# Altium project Flow_Pump.PrjPcb
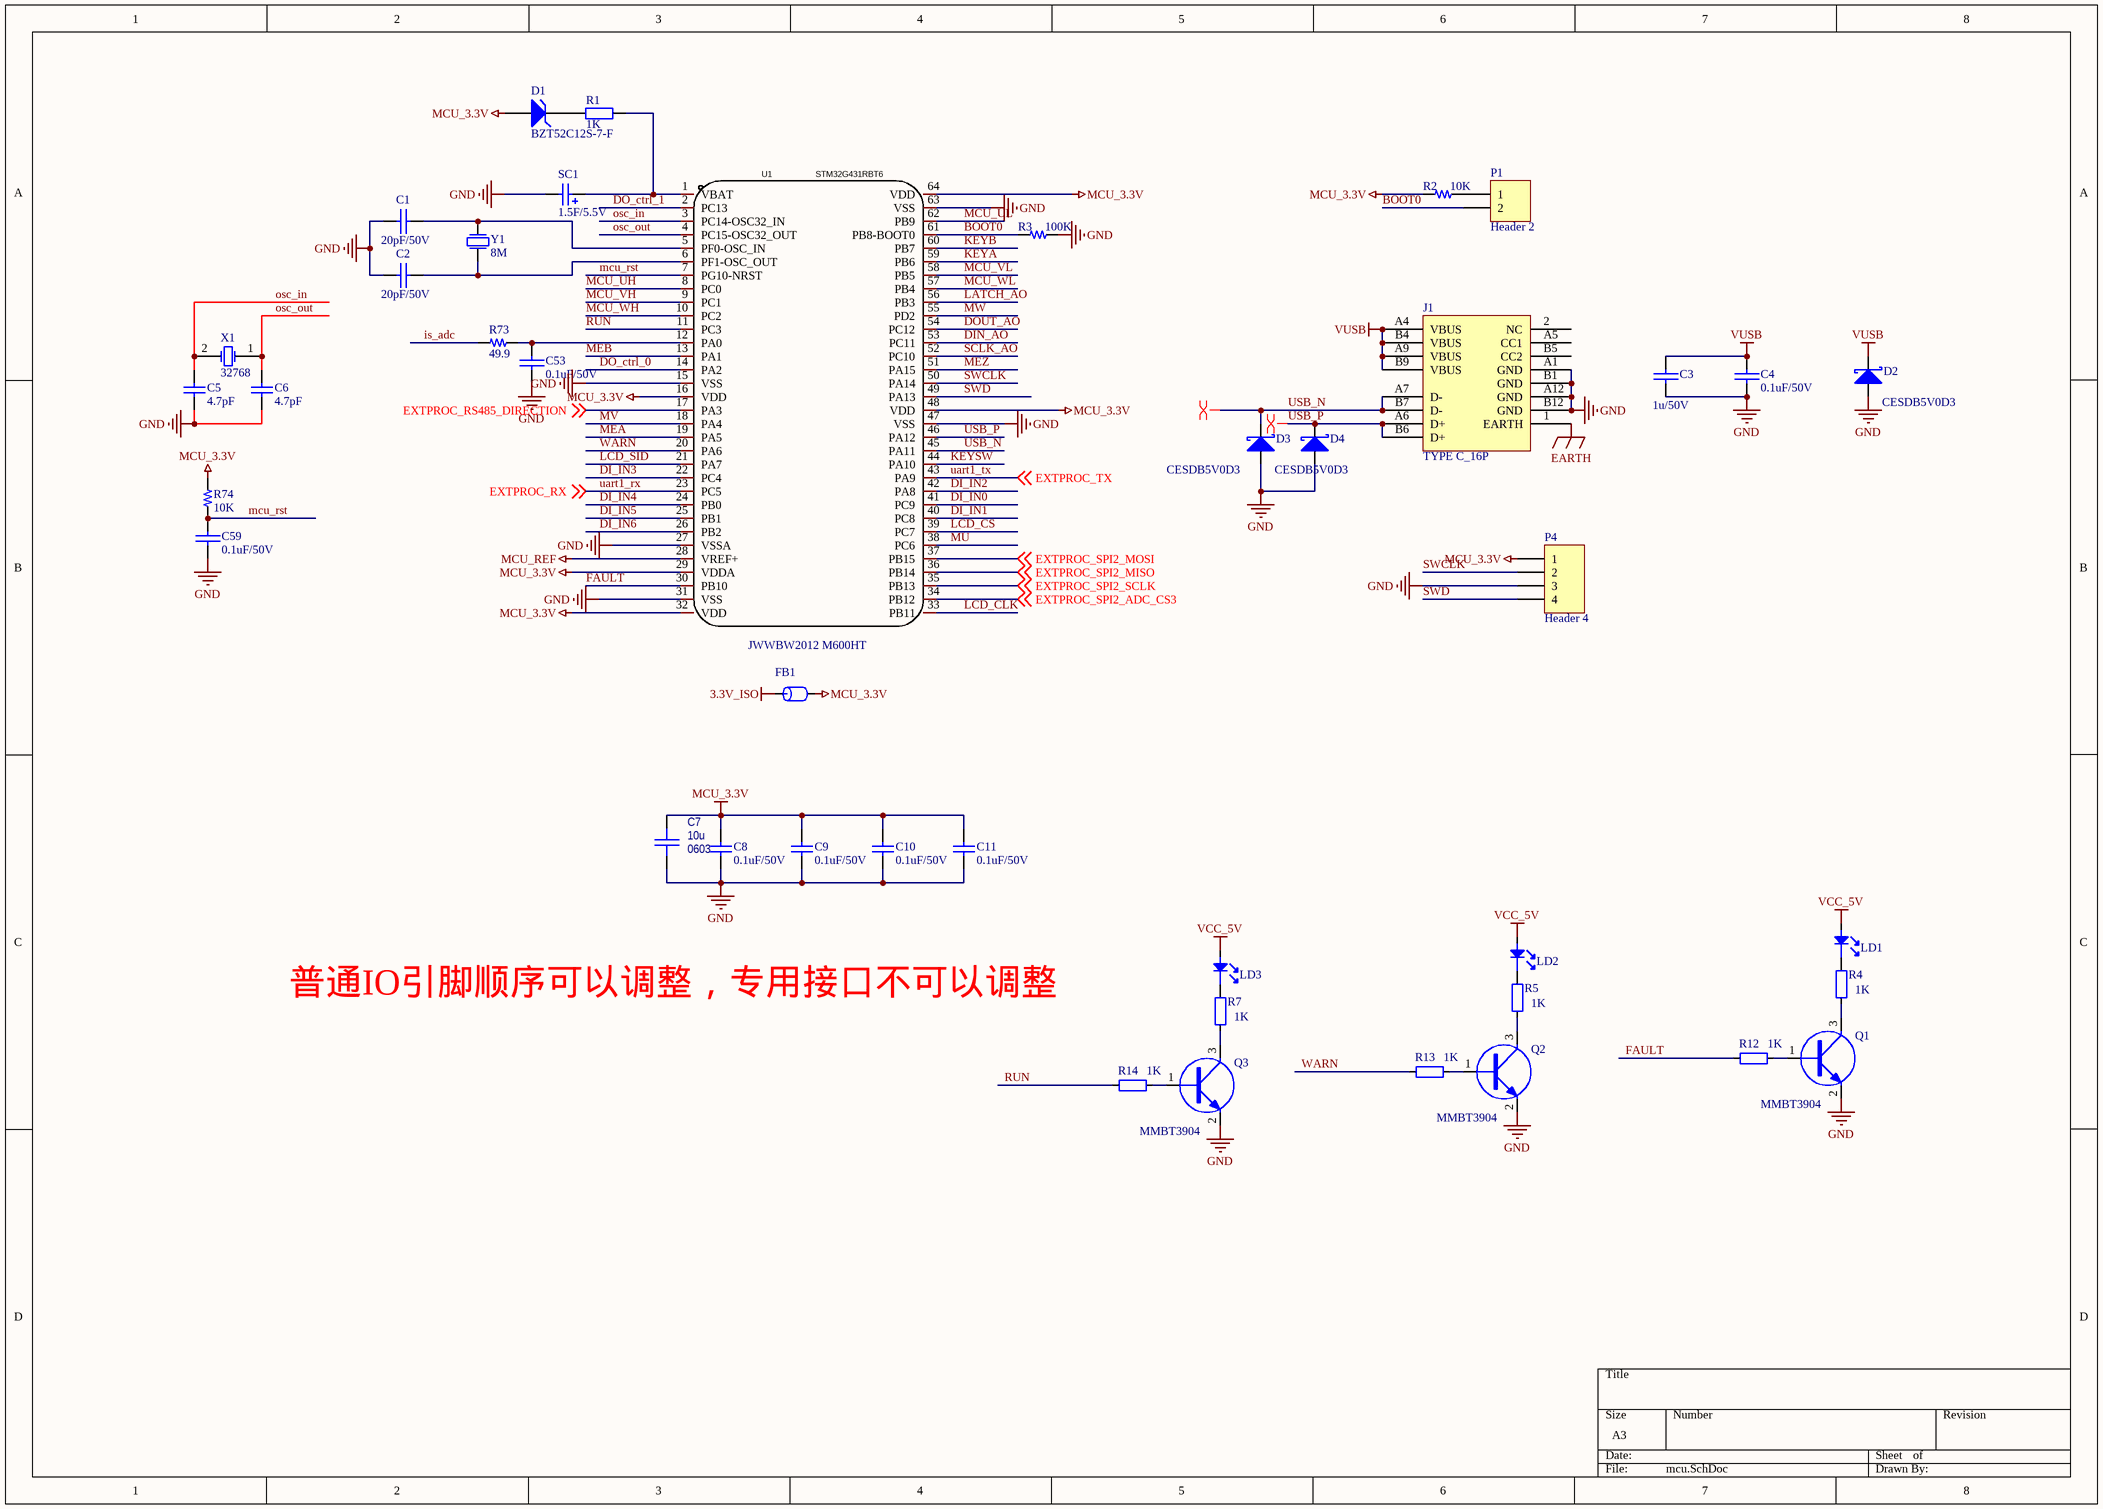
[diagram p0: mcu.SchDoc]
3 sheets, 131 parts. Net scope: global (net labels, ports and power ports of the same name join across sheets).
Board file: PCB1.PcbDoc
Sheets:
  mcu.SchDoc
  DI_DO.SchDoc
  blds.SchDoc

## Sheet mcu.SchDoc
size A3; SheetNumber: 1; SheetTotal: 4

### Parts
C1  value 20pF/50V  [0603C]  (hidden comment: 20pF/25V)
C2  value 20pF/50V  [0603C]  (hidden comment: 20pF/25V)
C3  value 1u/50V  [0603C]  (hidden comment: 1uF/25V)
C4  0.1uF/50V  [0603C]
C5  4.7pF  [0603C]
C6  4.7pF  [0603C]
C7  value 10u  Package: 0603  [CAPC1608X092N_0603]  (hidden comment: Capacitor_0603)
C8  0.1uF/50V  [0603C]
C9  0.1uF/50V  [0603C]
C10  0.1uF/50V  [0603C]
C11  0.1uF/50V  [0603C]
C53  0.1uF/50V  [0603C]
C59  0.1uF/50V  [0603C]
D1  BZT52C12S-7-F  [DIOD-SOD323-2_V]
D2  CESDB5V0D3  [SOD323]
D3  CESDB5V0D3  [SOD323]
D4  CESDB5V0D3  [SOD323]
FB1  JWWBW2012 M600HT  [0805R]
J1  TYPE C_16P  [TYPEC_16P]
LD1  LED_Green_19-217  [0603led]  (value not drawn)
LD2  LED_Green_19-217  [0603led]  (value not drawn)
LD3  LED_Green_19-217  [0603led]  (value not drawn)
P1  Header 2  [HDR1X2]
P4  Header 4  [HDR1X4]
Q1  MMBT3904  [SOT23-3]
Q2  MMBT3904  [SOT23-3]
Q3  MMBT3904  [SOT23-3]
R1  1K  [0603R]  (no BOM)
R2  10K  [0603R]
R3  100K  [0603R]
R4  1K  [0603r]
R5  1K  [0603r]
R7  1K  [0603r]
R12  1K  [0603r]
R13  1K  [0603r]
R14  1K  [0603r]
R73  49.9  [0603R]
R74  10K  [0603R]
SC1  1.5F/5.5V  [CAP-TH_DMS3R3224]
U1  STM32G431RBT6  [LQFP-64]
X1  32768  [A]
Y1  8M  [CRAY_5032]

### Nets
3.3V_ISO: FB1.1
EARTH: J1.1(EARTH)
GND: C1.2 C2.2 C3.1 C4.1 C5.2 C6.2 C7.2 C8.1 C9.1 C10.1 C11.1 C53.1 C59.1 D2.1(A) D3.1(A) D4.1(A) J1.A1(GND) J1.A12(GND) J1.B1(GND) J1.B12(GND) P4.3 Q1.2(E) Q2.2(E) Q3.2(E) R3.2 SC1.2 U1.15(VSS) U1.27(VSSA) U1.31(VSS) U1.47(VSS) U1.63(VSS)
MCU_3.3V: C7.1 C8.2 C9.2 C10.2 C11.2 D1.1(A) FB1.2 P4.1 R2.1 R74.1 U1.16(VDD) U1.29(VDDA) U1.32(VDD) U1.48(VDD) U1.64(VDD)
MCU_REF: U1.28(VREF+)
VCC_5V: LD1.1 LD2.1 LD3.1
VUSB: C3.2 C4.2 D2.2(K) J1.A4(VBUS) J1.A9(VBUS) J1.B4(VBUS) J1.B9(VBUS)
BOOT0: P1.2 R3.1 U1.61(PB8-BOOT0)
DI_IN0: U1.41(PC9)
DI_IN1: U1.40(PC8)
DI_IN2: U1.42(PA8)
DI_IN3: U1.22(PC4)
DI_IN4: U1.24(PB0)
DI_IN5: U1.25(PB1)
DI_IN6: U1.26(PB2)
DIN_AO: U1.53(PC11)
DO_ctrl_0: U1.14(PA2)
DO_ctrl_1: U1.2(PC13)
DOUT_AO: U1.54(PC12)
EXTPROC_RS485_DIRECTION: U1.17(PA3) ; off-sheet EXTPROC_RS485_DIRECTION
EXTPROC_SPI2_ADC_CS3: U1.34(PB12) ; off-sheet EXTPROC_SPI2_ADC_CS3
EXTPROC_SPI2_MISO: U1.36(PB14) ; off-sheet EXTPROC_SPI2_MISO
EXTPROC_SPI2_MOSI: U1.37(PB15) ; off-sheet EXTPROC_SPI2_MOSI
EXTPROC_SPI2_SCLK: U1.35(PB13) ; off-sheet EXTPROC_SPI2_SCLK
FAULT: R12.1 U1.30(PB10)
is_adc: R73.1
KEYA: U1.59(PB6)
KEYB: U1.60(PB7)
KEYSW: U1.44(PA10)
LATCH_AO: U1.56(PB3)
LCD_CLK: U1.33(PB11)
LCD_CS: U1.39(PC7)
LCD_SID: U1.21(PA7)
mcu_rst: C59.2 R74.2 U1.7(PG10-NRST)
MCU_UH: U1.8(PC0)
MCU_UL: U1.62(PB9)
MCU_VH: U1.9(PC1)
MCU_VL: U1.58(PB5)
MCU_WH: U1.10(PC2)
MCU_WL: U1.57(PB4)
MEA: U1.19(PA5)
MEB: U1.13(PA1)
MEZ: U1.51(PA15)
MU: U1.38(PC6)
MV: U1.18(PA4)
MW: U1.55(PD2)
osc_in: C5.1 U1.3(PC14-OSC32_IN) X1.2(OSC2)
osc_out: C6.1 U1.4(PC15-OSC32_OUT) X1.1(OSC1)
RUN: R14.1 U1.11(PC3)
SCLK_AO: U1.52(PC10)
SWCLK: P4.2 U1.50(PA14)
SWD: P4.4 U1.49(PA13)
uart1_rx: U1.23(PC5) ; off-sheet EXTPROC_RX  [also labelled EXTPROC_RX]
uart1_tx: U1.43(PA9) ; off-sheet EXTPROC_TX  [also labelled EXTPROC_TX]
USB_N: D3.2(K) J1.A7(D-) J1.B7(D-) U1.45(PA11)
USB_P: D4.2(K) J1.A6(D+) J1.B6(D+) U1.46(PA12)
WARN: R13.1 U1.20(PA6)
NetC1_1: C1.1 U1.5(PF0-OSC_IN) Y1.1(P1)
NetC2_1: C2.1 U1.6(PF1-OSC_OUT) Y1.2(P2)
NetC53_2: C53.2 R73.2 U1.12(PA0)
NetD1_2: D1.2(K) R1.1
NetLD1_2: LD1.2 R4.1
NetLD2_2: LD2.2 R5.1
NetLD3_2: LD3.2 R7.1
NetP1_1: P1.1 R2.2
NetQ1_1: Q1.1(B) R12.2
NetQ1_3: Q1.3(C) R4.2
NetQ2_1: Q2.1(B) R13.2
NetQ2_3: Q2.3(C) R5.2
NetQ3_1: Q3.1(B) R14.2
NetQ3_3: Q3.3(C) R7.2
NetR1_2: R1.2 SC1.1 U1.1(VBAT)

Not connected (* = marked no-connect by the designer): J1 2(NC) A5(CC1) B5(CC2)

### Layout directives
differential pair: USB_N, USB_P

### Notes on the sheet
- 普通IO引脚顺序可以调整，专用接口不可以调整

### Library data of the parts
C1-C4 C53 C59 = CAP
  C4 C53 C59: Value: 0.1uF/50V
C5 = Cap: Capacitor; Value: 6.8pF; Published: 8-Jun-2000; LatestRevisionDate: 17-Jul-2002; LatestRevisionNote: Re-released for DXP Platform.; PackageReference: RAD-0.3; Publisher: Altium Limited; PackageDescription: Radial Cap, Thru-Hole; 2 Leads; 0.3 in Pin Spacing
C6 = Cap: Capacitor; Published: 8-Jun-2000; LatestRevisionDate: 17-Jul-2002; LatestRevisionNote: Re-released for DXP Platform.; PackageReference: RAD-0.3; Publisher: Altium Limited; PackageDescription: Radial Cap, Thru-Hole; 2 Leads; 0.3 in Pin Spacing
C7 = Capacitor_0603: Capacitor, MLCC; Manufacturer: Murata Electronics; PartNumber: GRM188R61A106KE69D; Tolerance: [tol]; TempCo: [tempco]; Voltage Rating: [voltage]; Supplier 1: *; ComponentLink1URL: *; Supplier Part Number 1: *; ComponentLink1Description: Datasheet; SupplierDescription: CAP CER 10UF 10V X5R 0603
C8-C11 = Cap: Capacitor; Value: 22nF; Published: 8-Jun-2000; LatestRevisionDate: 17-Jul-2002; LatestRevisionNote: Re-released for DXP Platform.; PackageReference: RAD-0.3; Publisher: Altium Limited; PackageDescription: Radial Cap, Thru-Hole; 2 Leads; 0.3 in Pin Spacing
D1 = BZT52C12S-7-F: Zener Current: 5mA; Vz - Zener Voltage: 12V; Pd - Power Dissipation: 200mW; Zz - Zener Impedance: 40Ohms; Unit Weight: 0.000173oz; Voltage Temperature Coefficient: 0.25mV/C; Voltage Tolerance: 5%; Package Reference: SOD323-2; Minimum Operating Temperature: -65C; Packaging: Reel; Product Category: ZenerDiodes; Termination Style: SMD/SMT; Mounting Style: SMD/SMT; RoHS: True; Package / Case: SOD-323; Package Description: 2-Pin Surface Mount Device, Body 1.7 x 1.3 mm; Width: 1.4mm; Mounting Technology: SurfaceMount; Package URL: http://www.vishay.com/docs/71192/71192.pdf; Series: BZT52C12; Value: BZT52C12S-7-F
D2 D3 = DIODE S
D4 = DIODE S: Value: 0.1uF/50V
FB1 = FB: Part Field 1: 磁珠/0603/1K ohm/100MHz; FB: BLM18BD102SN1(muRata); Text Field1: FB
LD1-LD3 = LED_Green_19-217: 物料主编码(PN): 100000032; Value: 19-217/G7C-AN1P2/3T; ID: 6; 序号: 33; 物料名称: 绿色LED; 物料描述: Other,LED,绿色,0603,1.6X0.8X0.4mm,19-217/G7C-AN1P2/3T; 工作温度: –40°C to 85°C; 制造商: Everlight; 器件等级: ——; 物料类型: 特殊二极管; 规格型号(完整型号): 19-217/G7C-AN1P2/3T
Q1-Q3 = NPN_MMBT3904
R1 = Res0805M
R2 R3 R73 R74 = R: Value: 10k/1%
R4 R5 R7 R12-R14 = RES0603: 物料主编码(PN): 150000040; ID: 233; 序号: 109; 物料名称: 贴片电阻; 精度: ±1%; 规格型号(完整型号): RC1608F103CS/RC0603FR-0710KL; 物料描述: RES,贴片电阻,0603,10k,±1%,1/10W,1.6X0.8X0.45mm,RC1608F103CS/RC0603FR-0710KL; 工作温度: –55°C to 155°C; 制造商: 三星/YAGEO; 器件等级: ——; 物料类型: 表贴电阻; 参数值: 1.00E+04; Value: 1K
SC1 = Cap Pol2: Polarized Capacitor (Axial); Value: 100pF; Published: 8-Jun-2000; LatestRevisionDate: 17-Jul-2002; LatestRevisionNote: Re-released for DXP Platform.; PackageReference: POLAR0.8; Publisher: Altium Limited
U1 = STM32G431RBT6: Manufacturer: ST(意法半导体); Add into BOM: yes; Program Storage Size: 128KB; GPIO Ports Number: 52; Operating Voltage Range: 1.71V~3.6V; CPU Maximum Speed: 170MHz; ADC (Bit): 12bit; Watchdog: 有; Symbol: STM32G431RBT6; Device: STM32G431RBT6; LCSC Part Name: 带DSP和FPU的170MHz主流ARM Cortex-M4 MCU，具有128 KB Flash存储器、数学加速器和中等模拟电平集成; Supplier Part: C431633; Manufacturer Part: STM32G431RBT6; Supplier Footprint: LQFP-64(10x10); JLCPCB Part Class: Extended Part; Datasheet: https://atta.szlcsc.com/upload/public/pdf/source/20190925/C431633_8068E60CC825A086DCCD86A4BDED9458.pdf; Supplier: LCSC; Convert to PCB: yes; CPU Core: -; Operating Temperature Range: -40℃~+85℃; DAC (Bit): 12bit; Infrared Data Association: 有; Low-Voltage Detect: 有; Direct Memory Access: 有; Internal Oscillator: 有
X1 = XTAL: Crystal Oscillator; Published: 8-Jun-2000; LatestRevisionDate: 17-Jul-2002; LatestRevisionNote: Re-released for DXP Platform.; PackageReference: R38; Publisher: Altium Limited
Y1 = XTAL: Value: 8M
P1 = Header 2: Publisher: Altium Limited
P4 = Header 4: Publisher: Altium Limited

## Sheet DI_DO.SchDoc
size A3; SheetNumber: 4; SheetTotal: 4
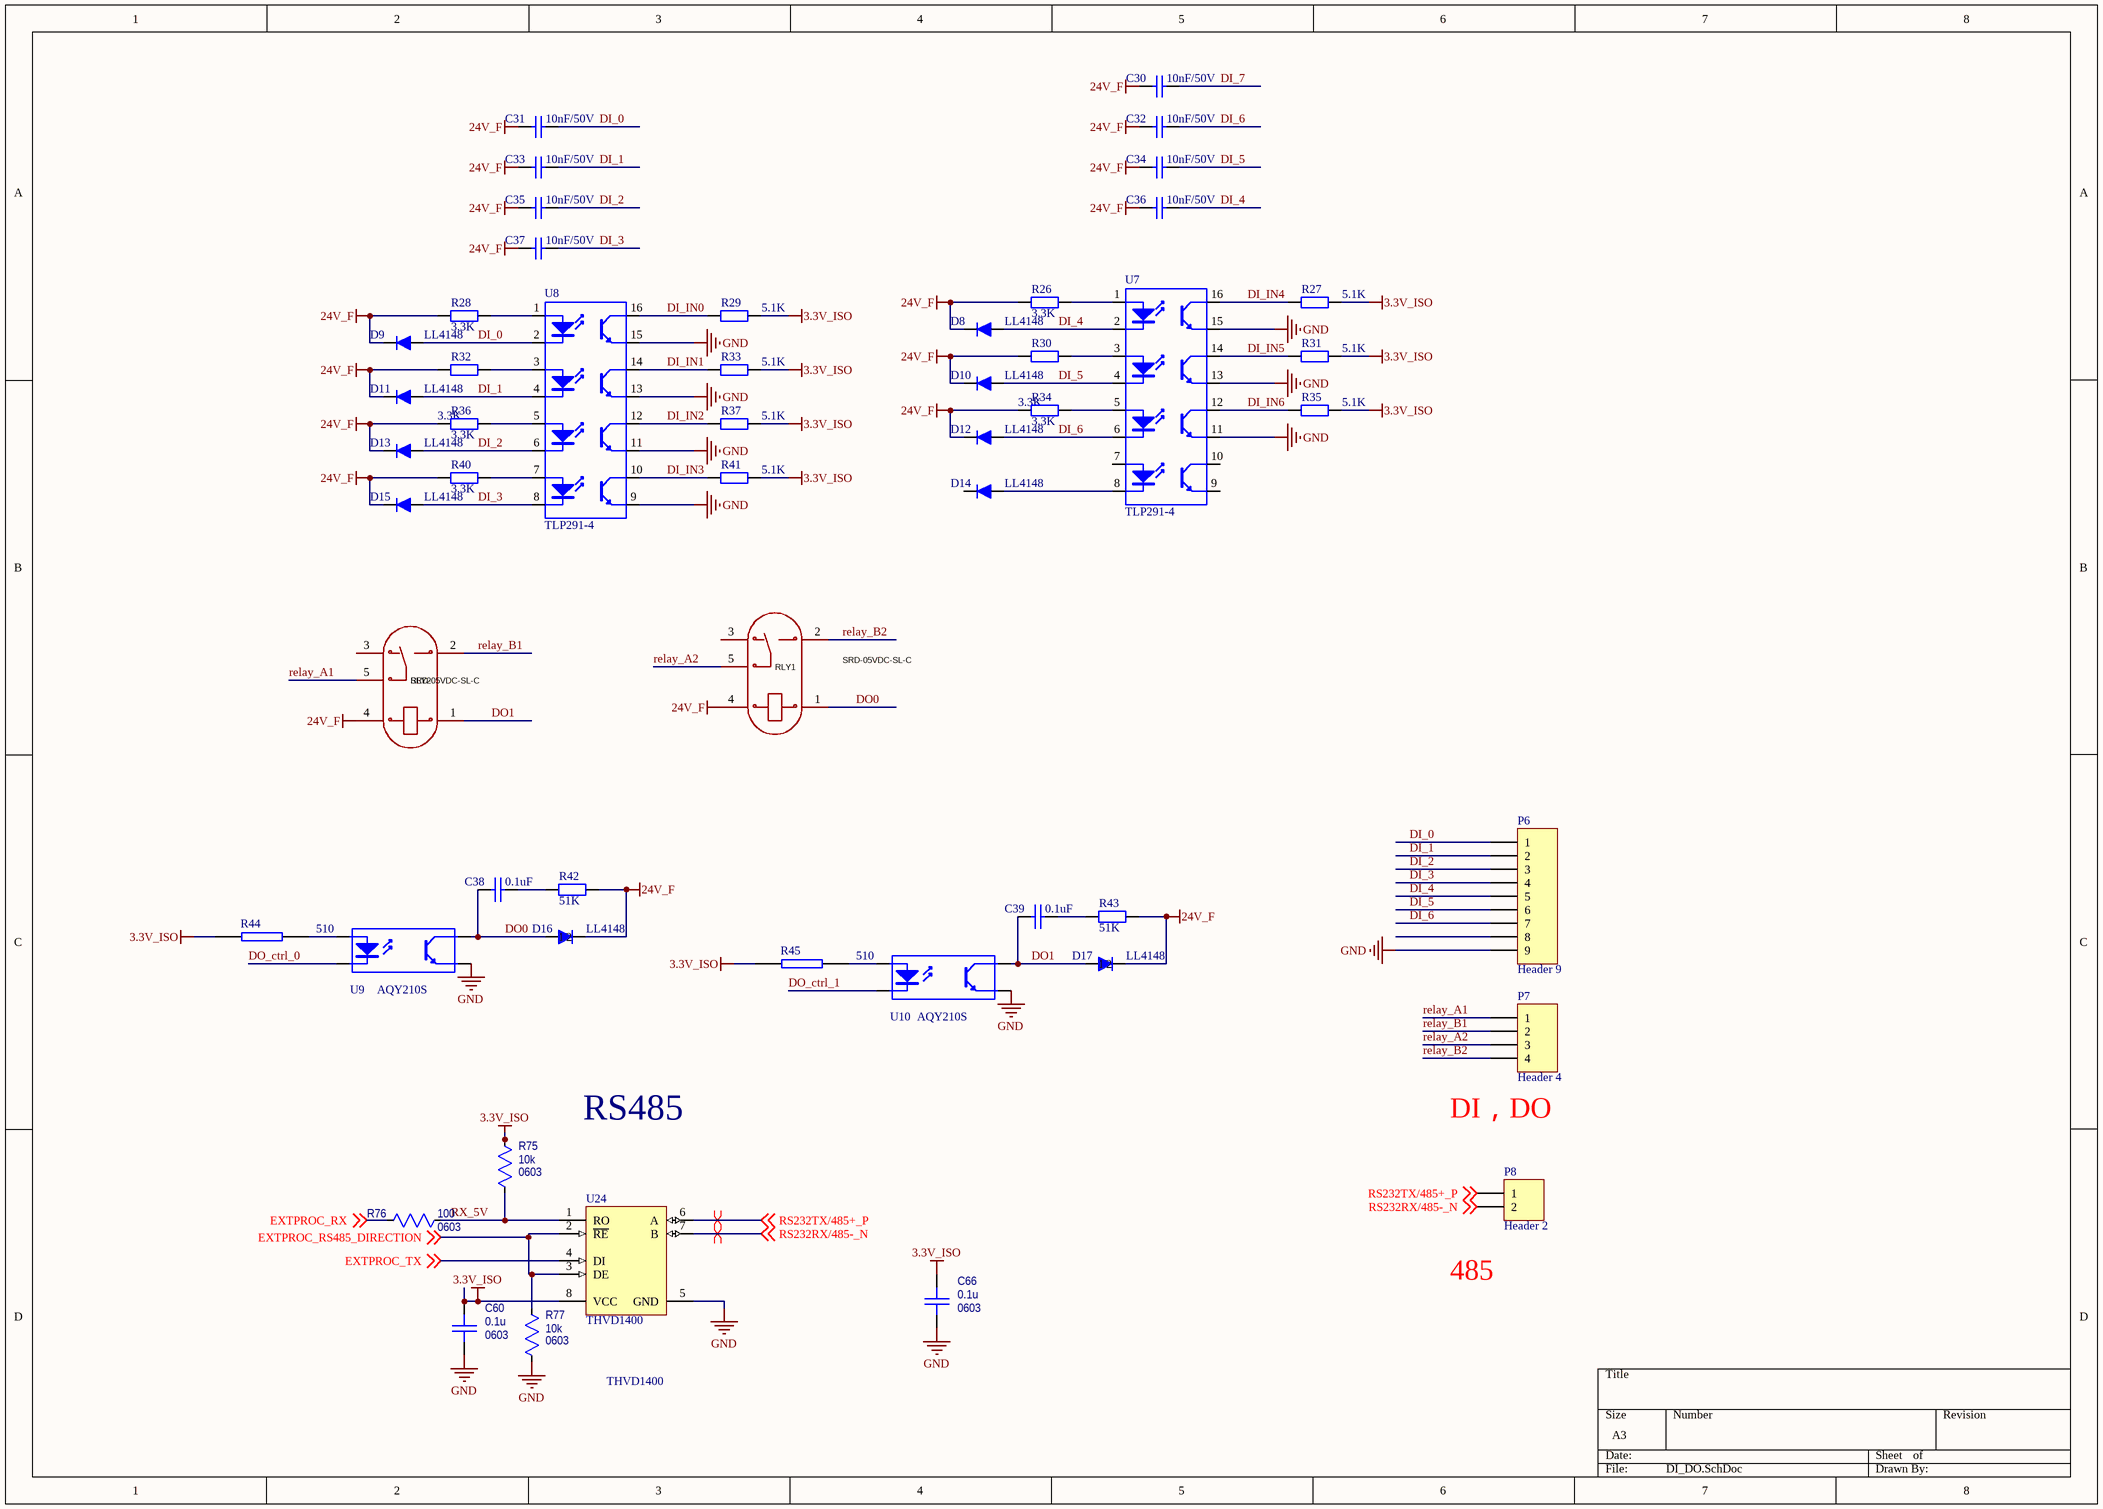
[diagram p1: DI_DO.SchDoc]

### Parts
C30  10nF/50V  [0603C]
C31  10nF/50V  [0603C]
C32  10nF/50V  [0603C]
C33  10nF/50V  [0603C]
C34  10nF/50V  [0603C]
C35  10nF/50V  [0603C]
C36  10nF/50V  [0603C]
C37  10nF/50V  [0603C]
C38  0.1uF  [0603C]
C39  0.1uF  [0603C]
C60  value 0.1u  Package: 0603  [CAPC1608X092N_0603]  (hidden comment: Capacitor_0603)
C66  value 0.1u  Package: 0603  [CAPC1608X092N_0603]  (hidden comment: Capacitor_0603)
D8  LL4148  [DO-213AB/LL34/MiniMELF]
D9  LL4148  [DO-213AB/LL34/MiniMELF]
D10  LL4148  [DO-213AB/LL34/MiniMELF]
D11  LL4148  [DO-213AB/LL34/MiniMELF]
D12  LL4148  [DO-213AB/LL34/MiniMELF]
D13  LL4148  [DO-213AB/LL34/MiniMELF]
D14  LL4148  [DO-213AB/LL34/MiniMELF]
D15  LL4148  [DO-213AB/LL34/MiniMELF]
D16  LL4148  [DO-213AB/LL34/MiniMELF]
D17  LL4148  [DO-213AB/LL34/MiniMELF]
P6  Header 9  [HDR1X9]
P7  Header 4  [HDR1X4]
P8  Header 2  [HDR1X2]
R26  3.3K  [0603R]
R27  5.1K  [0603R]
R28  3.3K  [0603R]
R29  5.1K  [0603R]
R30  3.3K  [0603R]
R31  5.1K  [0603R]
R32  3.3K  [0603R]
R33  5.1K  [0603R]
R34  3.3K  [0603R]
R35  5.1K  [0603R]
R36  3.3K  [0603R]
R37  5.1K  [0603R]
R40  3.3K  [0603R]
R41  5.1K  [0603R]
R42  51K  [0603R]
R43  51K  [0603R]
R44  510  [0603R]
R45  510  [0603R]
R75  value 10k  Package: 0603  [RESC1608X055N_0603]  (hidden comment: Resistor_0603)
R76  value 100  Package: 0603  [RESC1608X055N_0603]  (hidden comment: Resistor_0603)
R77  value 10k  Package: 0603  [RESC1608X055N_0603]  (hidden comment: Resistor_0603)
RLY1  SRD-05VDC-SL-C  [RELAY-TH_SRD-XXVDC-XL-C]
RLY2  SRD-05VDC-SL-C  [RELAY-TH_SRD-XXVDC-XL-C]
U7  TLP291-4  [SOP16-T]
U8  TLP291-4  [SOP16-T]
U9  AQY210S  [sop4]
U10  AQY210S  [sop4]
U24  THVD1400  [MAXM-S8+4_M]

### Nets
3.3V_ISO: C60.1 C66.1 R27.1 R29.1 R31.1 R33.1 R35.1 R37.1 R41.1 R44.2 R45.2 R75.2 U24.8(VCC)
24V_F: C30.1 C31.1 C32.1 C33.1 C34.1 C35.1 C36.1 C37.1 D8.2 D9.2 D10.2 D11.2 D12.2 D13.2 D15.2 D16.2(1) D17.2(1) R26.2 R28.2 R30.2 R32.2 R34.2 R36.2 R40.2 R42.2 R43.2 RLY1.4 RLY2.4
GND: C60.2 C66.2 P6.9 R77.1 U7.11(E) U7.13(E) U7.15(E) U8.9(E) U8.11(E) U8.13(E) U8.15(E) U9.3(E) U10.3(E) U24.5(GND)
DI_0: C31.2 D9.1 P6.1 U8.2(K)
DI_1: C33.2 D11.1 P6.2 U8.4(K)
DI_2: C35.2 D13.1 P6.3 U8.6(K)
DI_3: C37.2 D15.1 P6.4 U8.8(K)
DI_4: C36.2 D8.1 P6.5 U7.2(K)
DI_5: C34.2 D10.1 P6.6 U7.4(K)
DI_6: C32.2 D12.1 P6.7 U7.6(K)
DI_7: C30.2
DI_IN0: R29.2 U8.16(C)
DI_IN1: R33.2 U8.14(C)
DI_IN2: R37.2 U8.12(C)
DI_IN3: R41.2 U8.10(C)
DI_IN4: R27.2 U7.16(C)
DI_IN5: R31.2 U7.14(C)
DI_IN6: R35.2 U7.12(C)
DO0: C38.1 D16.1(2) RLY1.1 U9.4(C)
DO1: C39.1 D17.1(2) RLY2.1 U10.4(C)
DO_ctrl_0: U9.2(K)
DO_ctrl_1: U10.2(K)
EXTPROC_RS485_DIRECTION: R77.2 U24.2(~{RE}) U24.3(DE) ; off-sheet EXTPROC_RS485_DIRECTION
EXTPROC_RX: R76.2 ; off-sheet EXTPROC_RX  [project net uart1_rx]
EXTPROC_TX: U24.4(DI) ; off-sheet EXTPROC_TX  [project net uart1_tx]
relay_A1: P7.1 RLY2.5
relay_A2: P7.3 RLY1.5
relay_B1: P7.2 RLY2.2
relay_B2: P7.4 RLY1.2
RS232RX/485-_N: P8.2 U24.7(B) ; off-sheet RS232RX/485-_N
RS232TX/485+_P: P8.1 U24.6(A) ; off-sheet RS232TX/485+_P
RX_5V: R75.1 R76.1 U24.1(RO)
NetC38_2: C38.2 R42.1
NetC39_2: C39.2 R43.1
NetD14_1: D14.1 U7.8(K)
NetR26_1: R26.1 U7.1(A)
NetR28_1: R28.1 U8.1(A)
NetR30_1: R30.1 U7.3(A)
NetR32_1: R32.1 U8.3(A)
NetR34_1: R34.1 U7.5(A)
NetR36_1: R36.1 U8.5(A)
NetR40_1: R40.1 U8.7(A)
NetR44_1: R44.1 U9.1(A)
NetR45_1: R45.1 U10.1(A)

Not connected (* = marked no-connect by the designer): D14 2(1); P6 8; RLY1 3; RLY2 3; U7 7(A) 9(E) 10(C)

### Layout directives
differential pair: RS232RX/485-_N, RS232TX/485+_P

### Notes on the sheet
- RS485
- (near P7) DI，DO
- (near P8) 485
- THVD1400

### Library data of the parts
C30-C37 = Cap: Capacitor; Value: 22nF; Published: 8-Jun-2000; LatestRevisionDate: 17-Jul-2002; LatestRevisionNote: Re-released for DXP Platform.; PackageReference: RAD-0.3; Publisher: Altium Limited; PackageDescription: Radial Cap, Thru-Hole; 2 Leads; 0.3 in Pin Spacing
C38 C39 = CAP: Capacitor
C60 C66 = Capacitor_0603: Capacitor, MLCC; PartNumber: C0603C104M5RACTU; Tolerance: [tol]; TempCo: [tempco]; Voltage Rating: [voltage]; ComponentLink1URL: *; ComponentLink1Description: Datasheet; SupplierDescription: CAP CER 0.1UF 50V X7R 0603
D8-D17 = LL4148: VISHAY,LL4148,圆柱体MiniMELF100V/2A,ROHS; 版本: V1.00; 名称: 快速开关二极管; 物料编号: APLLY; 制造商: VISHAY
P6 = Header 9: Header, 9-Pin; LatestRevisionDate: 17-Jul-2002; LatestRevisionNote: Re-released for DXP Platform.; Publisher: Altium Limited
P7 = Header 4: Header, 4-Pin; LatestRevisionDate: 17-Jul-2002; LatestRevisionNote: Re-released for DXP Platform.; Publisher: Altium Limited
P8 = Header 2: Header, 2-Pin; LatestRevisionDate: 17-Jul-2002; LatestRevisionNote: Re-released for DXP Platform.; Publisher: Altium Limited
R26-R37 R40-R43 = Res0805M
R44 R45 = RES2
R75 R77 = Resistor_0603: Resistor, Standard; PartNumber: RC0603FR-0710KL; TempCo: [tempco]; Tolerance: tol; ComponentLink1URL: *; ComponentLink1Description: Datasheet; SupplierDescription: RES SMD 10K OHM 1% 1/10W 0603
R76 = Resistor_0603: Resistor, Standard; PartNumber: RC0603FR-07100RL; TempCo: [tempco]; Tolerance: tol; ComponentLink1URL: *; ComponentLink1Description: Datasheet; SupplierDescription: RES SMD 100 OHM 1% 1/10W 0603
RLY1 RLY2 = SRD-05VDC-SL-C: Manufacturer: 松乐; Add into BOM: yes; Coil Voltage: 5V; Contact Form: 一组转换:1C(单刀双掷-转换); Pin Number: 5; Maximum Switching Voltage: 250V@AC; Coil Rated Power: 360mW; Maximum Switching Current: 15A; Coil Type: 无极性-单线圈; Coil Resistance: 70Ω; Contact Resistance: 100mΩ; Operate Time: 10ms; Symbol: SRD-05VDC-SL-C; Device: SRD-05VDC-SL-C; LCSC Part Name: 蓝色; Supplier Part: C35449; Manufacturer Part: SRD-05VDC-SL-C; Supplier Footprint: 插件,15.6x19.2mm; JLCPCB Part Class: Extended Part; Datasheet: https://atta.szlcsc.com/upload/public/pdf/source/20200305/C490149_C96E4098A3B1FFB377D5AD2E40B7C2A8.pdf; Supplier: LCSC; Convert to PCB: yes; Contact Rating: -; Release Time: 10ms
U7 U8 = TLP281-4
U9 U10 = Optoisolator1: 4-Pin Phototransistor Optocoupler; Published: 24-Mar-1999; LatestRevisionDate: 04-Mar-2005; LatestRevisionNote: Sch pins 3 & 4 Swapped.; DatasheetVersion: Nov-2003; PackageReference: DIP-4; Publisher: Altium Limited
U24 = MAX33071EASA+: RS-485 Half-Duplex Transceiver with ±65V Fault Protection,+3V to +5.5V, -40 to 125 degC, 8-Pin SOIC (S8+4), RoHS, Tube; VOUT: 3.000 V; VIN: 3.2 to 12.6 V; PartNumber: MAX33071EASA+; ComponentLink1URL: http://www.maximintegrated.com/; ComponentLink1Description: Manufacturer URL; ComponentLink2URL: https://datasheets.maximintegrated.com/en/ds/MAX33070E-MAX33071E.pdf; ComponentLink2Description: Datasheet; Value: MAX33071EASA+

## Sheet blds.SchDoc
size A2
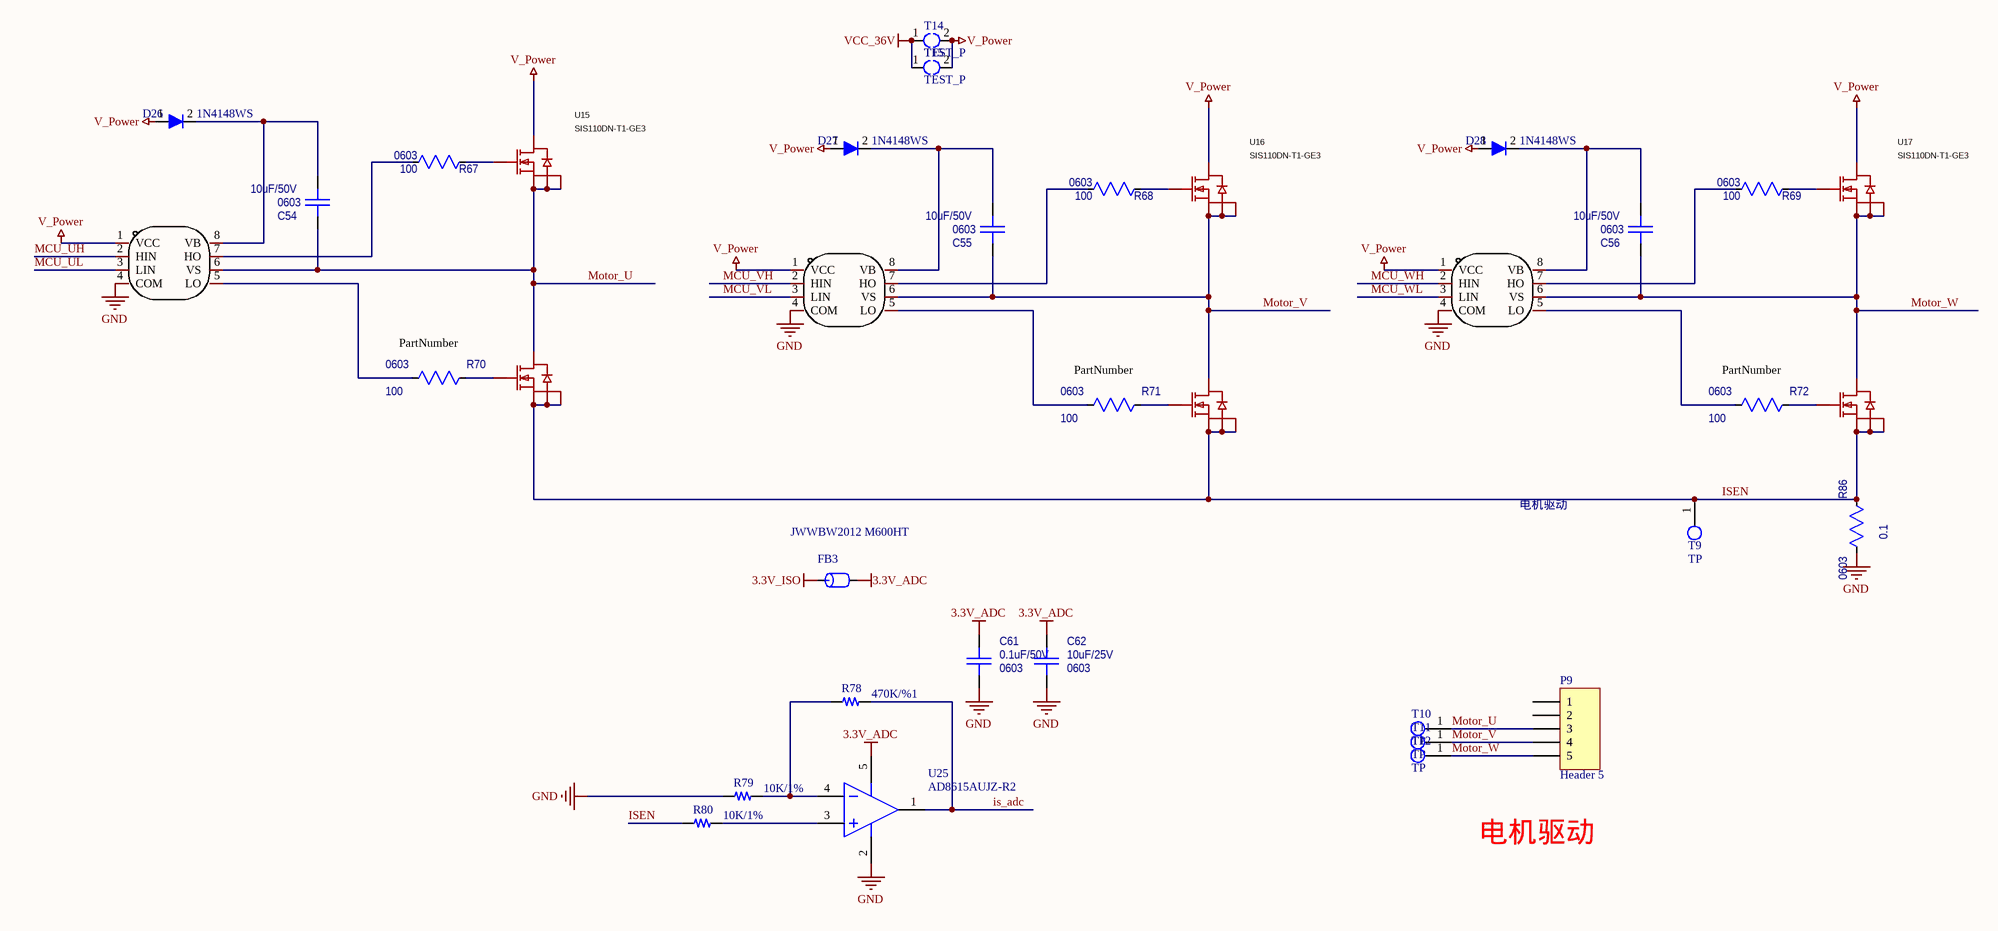
[diagram p2: blds.SchDoc]

### Parts
C54  10uF/50V  Package: 0603  [CAPC1608X092N_0603]
C55  10uF/50V  Package: 0603  [CAPC1608X092N_0603]
C56  10uF/50V  Package: 0603  [CAPC1608X092N_0603]
C61  value 0.1uF/50V  Package: 0603  [CAPC1608X092N_0603]  (hidden comment: Capacitor_0603)
C62  value 10uF/25V  Package: 0603  [CAPC1608X092N_0603]  (hidden comment: Capacitor_0603)
D26  1N4148WS  [SOD323]
D27  1N4148WS  [SOD323]
D28  1N4148WS  [SOD323]
FB3  JWWBW2012 M600HT  [0805R]
P9  Header 5  [HDR1X5]
R67  value 100  Package: 0603  [RESC1608X055N_0603]  (hidden comment: Resistor_0603)
R68  value 100  Package: 0603  [RESC1608X055N_0603]  (hidden comment: Resistor_0603)
R69  value 100  Package: 0603  [RESC1608X055N_0603]  (hidden comment: Resistor_0603)
R70  value 100  Package: 0603  [RESC1608X055N_0603]  (hidden comment: Resistor_0603)
R71  value 100  Package: 0603  [RESC1608X055N_0603]  (hidden comment: Resistor_0603)
R72  value 100  Package: 0603  [RESC1608X055N_0603]  (hidden comment: Resistor_0603)
R78  value 470K/%1  [0603R]
R79  value 10K/1%  [0603R]
R80  value 10K/1%  [0603R]
R86  Package: 0603  [2010R]  (hidden comment: 0.1)
T9  TP  [TPD]
T10  TP  [TPD]
T11  TP  [TPD]
T12  TP  [TPD]
T14  TEST_P  [TEST_P]
T15  TEST_P  [TEST_P]
U15  SIS110DN-T1-GE3  [DFN-8_L3.3-W3.3-P0.65-BL-2]
U16  SIS110DN-T1-GE3  [DFN-8_L3.3-W3.3-P0.65-BL-2]
U17  SIS110DN-T1-GE3  [DFN-8_L3.3-W3.3-P0.65-BL-2]
U18  IRS21867STRPBF  [SO-8]  (value not drawn)
U19  IRS21867STRPBF  [SO-8]  (value not drawn)
U20  IRS21867STRPBF  [SO-8]  (value not drawn)
U21  SIS110DN-T1-GE3  [DFN-8_L3.3-W3.3-P0.65-BL-2]  (value not drawn)
U22  SIS110DN-T1-GE3  [DFN-8_L3.3-W3.3-P0.65-BL-2]  (value not drawn)
U23  SIS110DN-T1-GE3  [DFN-8_L3.3-W3.3-P0.65-BL-2]  (value not drawn)
U25  AD8615AUJZ-R2  [sot-23-5]

### Nets
3.3V_ADC: C61.1 C62.1 FB3.2 U25.5(VCC)
3.3V_ISO: FB3.1
GND: C61.2 C62.2 R79.2 R86.1 U18.4(COM) U19.4(COM) U20.4(COM) U25.2(G)
V_Power: D26.1(K) D27.1(K) D28.1(K) T14.2 T15.2 U15.5(D) U16.5(D) U17.5(D) U18.1(VCC) U19.1(VCC) U20.1(VCC)
VCC_36V: T14.1 T15.1
is_adc: R78.1 U25.1(OS_NUL)
ISEN: R80.2 R86.2 T9.1 U21.1(S) U21.2(S) U21.3(S) U22.1(S) U22.2(S) U22.3(S) U23.1(S) U23.2(S) U23.3(S)
MCU_UH: U18.2(HIN)
MCU_UL: U18.3(LIN)
MCU_VH: U19.2(HIN)
MCU_VL: U19.3(LIN)
MCU_WH: U20.2(HIN)
MCU_WL: U20.3(LIN)
Motor_U: C54.1 P9.3 T10.1 U15.1(S) U15.2(S) U15.3(S) U18.6(VS) U21.5(D)
Motor_V: C55.1 P9.4 T11.1 U16.1(S) U16.2(S) U16.3(S) U19.6(VS) U22.5(D)
Motor_W: C56.1 P9.5 T12.1 U17.1(S) U17.2(S) U17.3(S) U20.6(VS) U23.5(D)
NetC54_2: C54.2 D26.2(A) U18.8(VB)
NetC55_2: C55.2 D27.2(A) U19.8(VB)
NetC56_2: C56.2 D28.2(A) U20.8(VB)
NetR67_1: R67.1 U18.7(HO)
NetR67_2: R67.2 U15.4(G)
NetR68_1: R68.1 U19.7(HO)
NetR68_2: R68.2 U16.4(G)
NetR69_1: R69.1 U20.7(HO)
NetR69_2: R69.2 U17.4(G)
NetR70_1: R70.1 U18.5(LO)
NetR70_2: R70.2 U21.4(G)
NetR71_1: R71.1 U19.5(LO)
NetR71_2: R71.2 U22.4(G)
NetR72_1: R72.1 U20.5(LO)
NetR72_2: R72.2 U23.4(G)
NetR78_2: R78.2 R79.1 U25.4(V-)
NetR80_1: R80.1 U25.3(V+)

Not connected (* = marked no-connect by the designer): P9 1 2

### Notes on the sheet
- (near R70) PartNumber
- (near R71) PartNumber
- (near R72) PartNumber
- 电机驱动

### Library data of the parts
C54-C56 = Capacitor_0603: Capacitor, MLCC; Manufacturer: muRata; PartNumber: GQM2195C2E4R7CB12J; Tolerance: [tol]; TempCo: [tempco]; Voltage Rating: [voltage]; Value: 4.7pF; ComponentLink1URL: *; Current Rating: *; ComponentLink1Description: Datasheet; Power Rating: *; SupplierDescription: CAP CER 1nF 50V X7R 0603
C61 C62 = Capacitor_0603: PartNumber: C0603C104M5RACTU; Tolerance: [tol]; TempCo: [tempco]; Voltage Rating: [voltage]; Supplier 1: *; Supplier Part Number 1: *; SupplierDescription: CAP CER 0.1UF 50V X7R 0603
D26-D28 = LL4148: 版本: V1.00; 名称: 快速开关二极管; 物料编号: APLLY; 制造商: VISHAY; Value: LL4148
FB3 = FB: as FB1 on sheet mcu; Text Field1: FB
P9 = Header 5: Header, 5-Pin; LatestRevisionDate: 17-Jul-2002; LatestRevisionNote: Re-released for DXP Platform.; Publisher: Altium Limited
R67-R72 R86 = Resistor_0603: Resistor, Standard; Manufacturer: Yageo; PartNumber: RC0603FR-0710KL; Power Rating: [power]; TempCo: [tempco]; Tolerance: tol; ComponentLink1URL: *; ComponentLink1Description: Datasheet; SupplierDescription: RES SMD 10K OHM 1% 1/10W 0603
  R86: Value: 0.1
R78-R80 = R
U15-U17 U21-U23 = SIS110DN-T1-GE3: Manufacturer: VISHAY(威世); Add into BOM: yes; Symbol: SIS110DN-T1-GE3; Device: SIS110DN-T1-GE3; LCSC Part Name: SIS110DN-T1-GE3; Supplier Part: C5334354; Manufacturer Part: SIS110DN-T1-GE3; Supplier Footprint: SO-8; JLCPCB Part Class: Extended Part; Datasheet: https://atta.szlcsc.com/upload/public/pdf/source/20221230/028E61738915F263ABF2615161A8D7B6.pdf; Supplier: LCSC; Convert to PCB: yes
U18-U20 = IRS21867STRPBF: Manufacturer: Infineon(英飞凌); Add into BOM: yes; Driven Configuration: 半桥; Load Type: MOSFET；IGBT; Number of Drivers: 2; Peak Output Current(sink): 4A; Supply Voltage: 10V~20V; Rise Time: 22ns; Fall Time: 18ns; Symbol: IRS21867STRPBF; Device: IRS21867STRPBF; LCSC Part Name: IRS21867STRPBF; Supplier Part: C52290; Manufacturer Part: IRS21867STRPBF; Supplier Footprint: SOIC-8; JLCPCB Part Class: Extended Part; Datasheet: https://atta.szlcsc.com/upload/public/pdf/source/20161024/1477287953380.pdf; Supplier: LCSC; Convert to PCB: yes; Peak Output Current(source): 4A; Operating Temperature: -40℃~+150℃@(Tj)
U25 = AD8615: Value: AD8615AUJZ-R2

## Nets that join several sheets
3.3V_ISO: mcu (FB1.1), DI_DO (13 pins), blds (FB3.1)
GND: mcu (31 pins), DI_DO (14 pins), blds (8 pins)
DI_IN0: mcu (U1.41), DI_DO (R29.2 U8.16)
DI_IN1: mcu (U1.40), DI_DO (R33.2 U8.14)
DI_IN2: mcu (U1.42), DI_DO (R37.2 U8.12)
DI_IN3: mcu (U1.22), DI_DO (R41.2 U8.10)
DI_IN4: mcu (U1.24), DI_DO (R27.2 U7.16)
DI_IN5: mcu (U1.25), DI_DO (R31.2 U7.14)
DI_IN6: mcu (U1.26), DI_DO (R35.2 U7.12)
DO_ctrl_0: mcu (U1.14), DI_DO (U9.2)
DO_ctrl_1: mcu (U1.2), DI_DO (U10.2)
EXTPROC_RS485_DIRECTION: mcu (U1.17), DI_DO (R77.2 U24.2 U24.3)
is_adc: mcu (R73.1), blds (R78.1 U25.1)
MCU_UH: mcu (U1.8), blds (U18.2)
MCU_UL: mcu (U1.62), blds (U18.3)
MCU_VH: mcu (U1.9), blds (U19.2)
MCU_VL: mcu (U1.58), blds (U19.3)
MCU_WH: mcu (U1.10), blds (U20.2)
MCU_WL: mcu (U1.57), blds (U20.3)
uart1_rx: mcu (U1.23), DI_DO (R76.2)
uart1_tx: mcu (U1.43), DI_DO (U24.4)